# EAGLE design mainBoard (EAGLE 7.6.0)
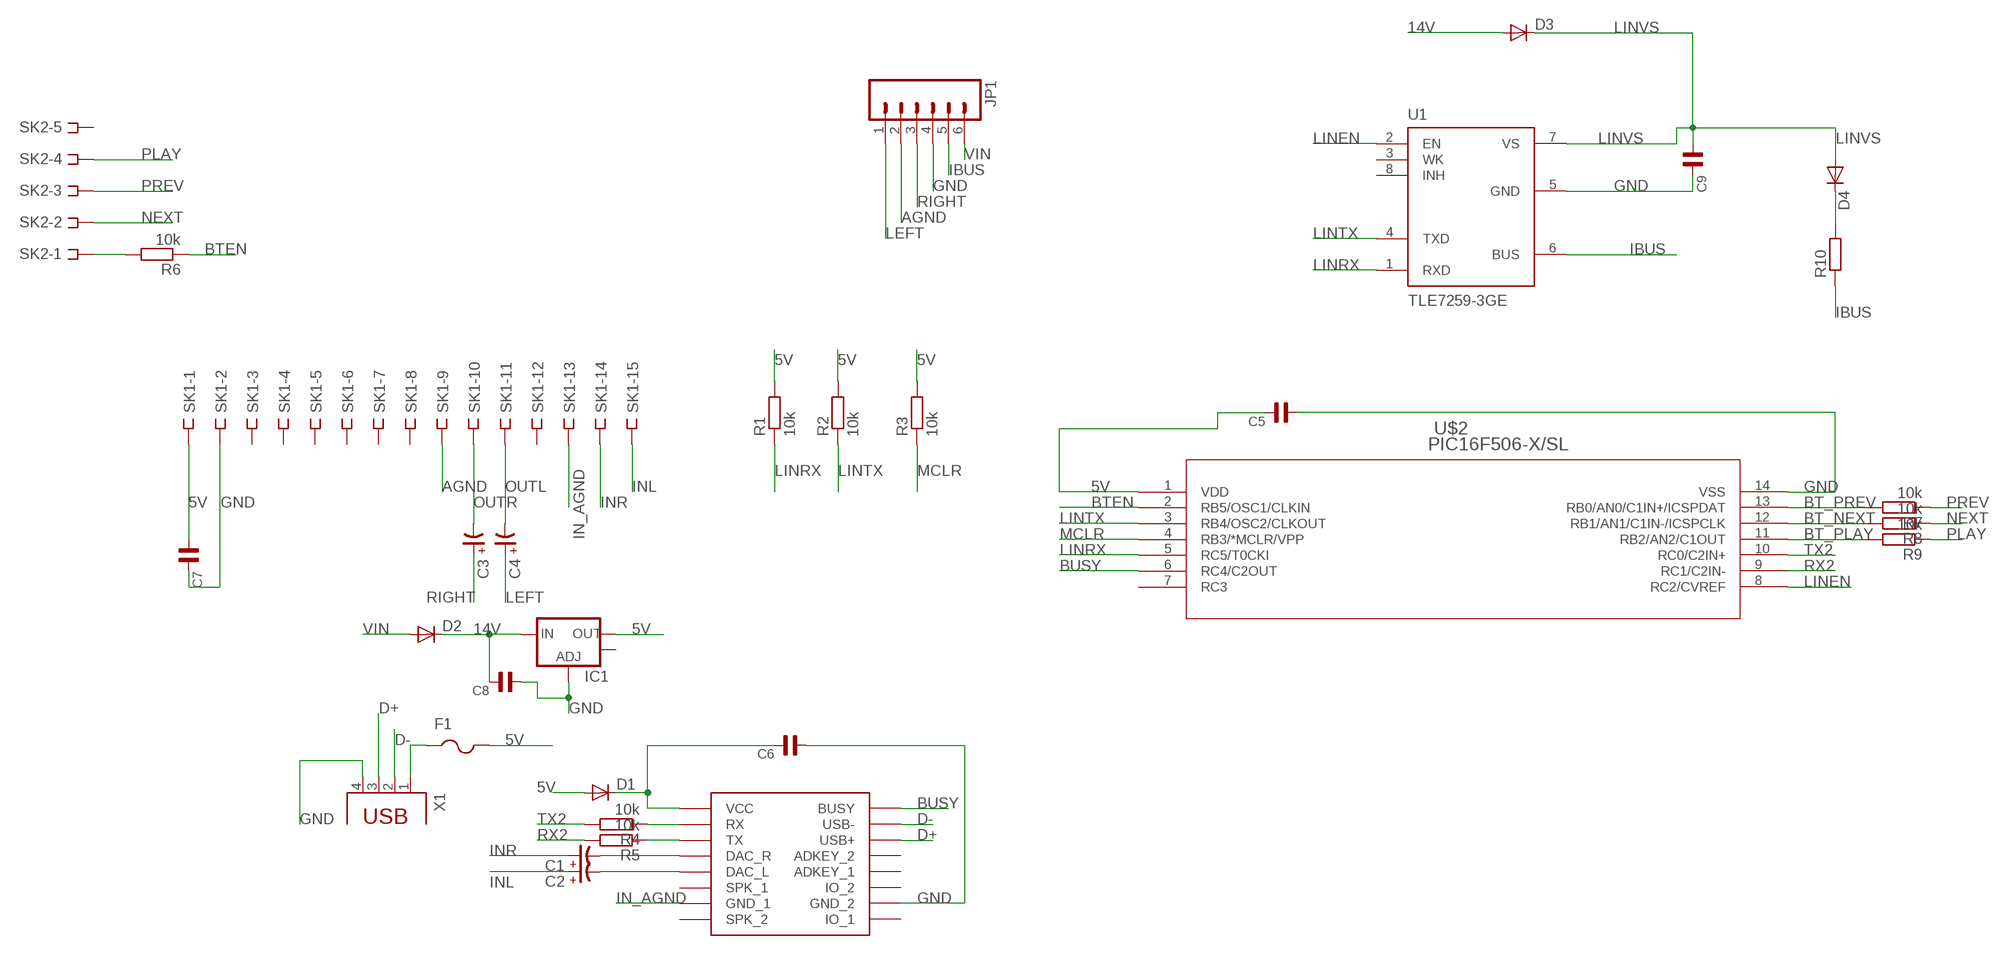
[diagram p0: schematic, sheet 1]

## Parts
C1  CP-3258-TE-B  [3528-TE-B]
C2  CP-3258-TE-B  [3528-TE-B]
C3  CP-3258-TE-B  [3528-TE-B]
C4  CP-3258-TE-B  [3528-TE-B]
C5  C0603  [0603]
C6  C0603  [0603]
C7  C0603  [0603]
C8  C1206  [1206]
C9  C0603  [0603]
D1  DIODESMA-ALT  [SMA-DIODE_ALT]
D2  DIODESMA-ALT  [SMA-DIODE_ALT]
D3  DIODE-SOD80C  [SOD80C]
D4  DIODE-SOD80C  [SOD80C]
F1  PTCFUSE-1812  [1812]
IC1  V_REG_LM1117SOT223  [SOT223]
JP1  M06LONGPADS  [1X06_LONGPADS]
R1  10k  R-EU_R0603  [R0603]
R2  10k  R-EU_R0603  [R0603]
R3  10k  R-EU_R0603  [R0603]
R4  10k  R-EU_R0603  [R0603]
R5  10k  R-EU_R0603  [R0603]
R6  10k  R-EU_R0603  [R0603]
R7  10k  R-EU_R0603  [R0603]
R8  10k  R-EU_R0603  [R0603]
R9  10k  R-EU_R0603  [R0603]
R10  R-EU_R0603  [R0603]
SK1  DF3-15S  [DF3S-15]
SK2  DF3-05S  [DF3S-05]
U1  TLE7259-3GE  [SOIC127P600X175-8N-3]
U$1  DFPLAYER  [DFPLAYER]
U$2  PIC16F506-X/SL  [SOIC14-N_MC]
X1  PN87520  [PN87520]

## Nets
5V: C5.2 C7.1 D1.A F1.2 IC1.2(OUT) R1.2 R2.2 R3.2 SK1.1 U$2.1(VDD)
14V: C8.2 D2.C D3.A IC1.3(IN)
AGND: JP1.2 SK1.9
BT_NEXT: R8.2 U$2.12(RB1/AN1/C1IN-/ICSPCLK)
BT_PLAY: R9.2 U$2.11(RB2/AN2/C1OUT)
BT_PREV: R7.2 U$2.13(RB0/AN0/C1IN+/ICSPDAT)
BTEN: R6.1 U$2.2(RB5/OSC1/CLKIN)
BUSY: U$1.BUSY U$2.6(RC4/C2OUT)
D+: U$1.USB+ X1.3
D-: U$1.USB- X1.2
GND: C5.1 C6.1 C7.2 C8.1 C9.2 IC1.1(ADJ) JP1.4 SK1.2 U1.5(GND) U$1.GND_2 U$2.14(VSS) X1.4
IBUS: JP1.5 R10.1 U1.6(BUS)
IN_AGND: SK1.13 U$1.GND_1
INL: C2.+ SK1.15
INR: C1.+ SK1.14
LEFT: C4.+ JP1.1
LINEN: U1.2(EN) U$2.8(RC2/CVREF)
LINRX: R1.1 U1.1(RXD) U$2.5(RC5/T0CKI)
LINTX: R2.1 U1.4(TXD) U$2.3(RB4/OSC2/CLKOUT)
LINVS: C9.1 D3.C D4.A U1.7(VS)
MCLR: R3.1 U$2.4(RB3/*MCLR/VPP)
N$1: C2.- U$1.DAC_L
N$2: C1.- U$1.DAC_R
N$3: C6.2 D1.C U$1.VCC
N$4: R4.1 U$1.RX
N$5: R5.1 U$1.TX
N$6: F1.1 X1.1
N$7: D4.C R10.2
N$8: R6.2 SK2.1
NEXT: R8.1 SK2.2
OUTL: C4.- SK1.11
OUTR: C3.- SK1.10
PLAY: R9.1 SK2.4
PREV: R7.1 SK2.3
RIGHT: C3.+ JP1.3
RX2: R5.2 U$2.9(RC1/C2IN-)
TX2: R4.2 U$2.10(RC0/C2IN+)
VIN: D2.A JP1.6
Unconnected: IC1.4(OUT) SK1.3 SK1.4 SK1.5 SK1.6 SK1.7 SK1.8 SK1.12 SK2.5 U1.3(WK) U1.8(INH) U$1.ADKEY1(ADKEY_1) U$1.ADKEY2(ADKEY_2) U$1.IO1(IO_1) U$1.IO2(IO_2) U$1.SPK1(SPK_1) U$1.SPK2(SPK_2) U$2.7(RC3)

## Library data of the parts
C1-C4 = cap-master:CP-: POLARIZED CAP
C5-C7 C9 = capsmd:C0603
C8 = capsmd:C1206
D1 D2 = SparkFun-DiscreteSemi:DIODE: Diode These are standard reverse protection diodes and small signal diodes. SMA package can handle up to about 1A. SOD-323 can handle about 200mA. What the SOD-323 package when ordering, there are some mfgs out there that are 5-pin packages.
D3 D4 = _mod_diode:DIODE-: DIODE
F1 = adafruit:PTCFUSE: PTC fuses, resettable thermistors
IC1 = SparkFun-PowerIC:V_REG_LM1117: Voltage Regulator LM1117 Standard adjustable voltage regulator but in SMD form. Spark Fun Electronics SKU : COM-00595
JP1 = SparkFun-Connectors:M06: Header 6 Standard 6-pin 0.1" header. Use with straight break away headers (SKU : PRT-00116), right angle break away headers (PRT-00553), swiss pins (PRT-00743), machine pins (PRT-00117), and female headers (PRT-00115). Molex polarized connector foot print use with SKU : PRT-08094 with associated crimp pins and housings. NOTES ON THE VARIANTS LOCK and LOCK_LONGPADS... This footprint was designed to help hold the alignment of a through-hole component (i.e. 6-pin header) while soldering it into place. You may notice that each hole has been shifted either up or down by 0.005 of an inch from it's more standard position (which is a perfectly straight line). This slight alteration caused the pins (the squares in the middle) to touch the edges of the holes. Because they are alternating, it causes a "brace" to hold the component in place. 0.005 has proven to be the perfect amount of "off-center" position when using our standard breakaway headers. Although looks a little odd when you look at the bare footprint, once you have a header in there, the alteration is very hard to notice. Also,if you push a header all the way into place, it is covered up entirely on the bottom side. This idea of altering the position of holes to aid alignment will be further integrated into the Sparkfun Library for other footprints. It can help hold any component with 3 or more connection pins.
R1-R10 = resistor:R-EU_: RESISTOR, European symbol
SK1 = con-hirose-df3:DF3-15S: Single row female connector 2mm 15 way
SK2 = con-hirose-df3:DF3-05S: Single row female connector 2mm 5 way
U1 = TLE7259-3GE:TLE7259-3GE: TLE7259-3GE Single Wire LIN Transceiver SOIC127P600X175-8N-3
U$1 = DFPlayer_v1:DFPLAYER
U$2 = PIC16F506_SOIC:PIC16F506-X/SL
X1 = con-berg:PN87520: BERG USB connector; OC_FARNELL: unknown; OC_NEWARK: unknown

## Board
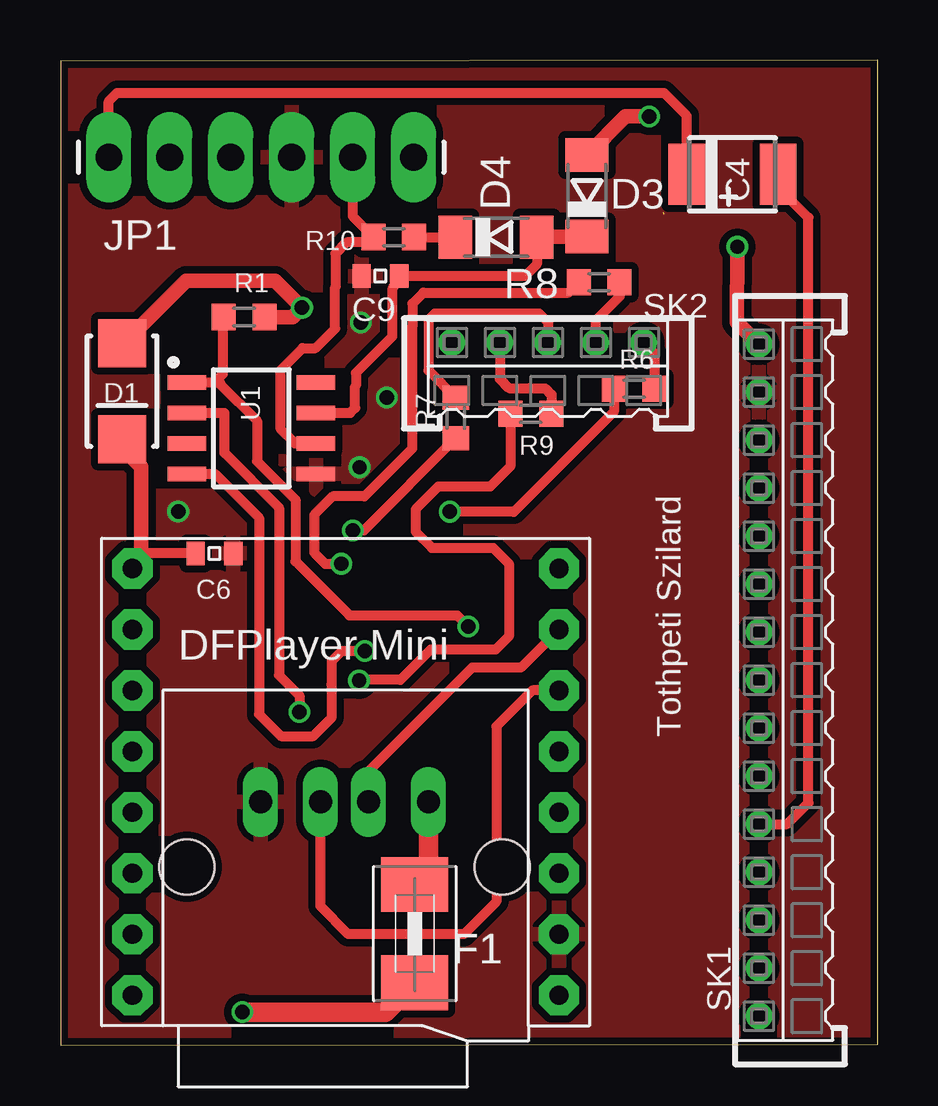
[diagram p1: board, top side]
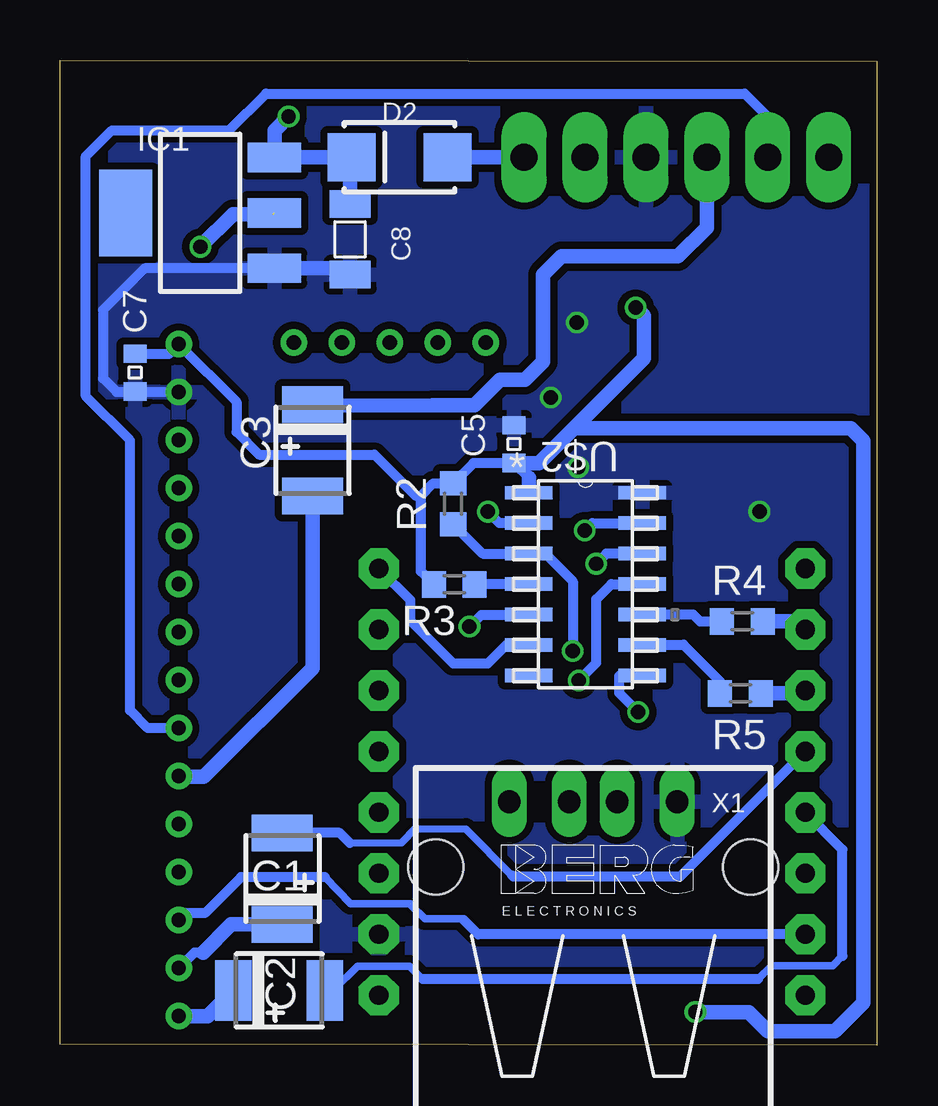
[diagram p2: board, bottom side, seen from below]

Size 34.05 x 41.05 mm. Coordinates in mm from the lower left corner, seen from the top.
Outline: 0,0 34.05,0.05 34.05,41.05 0,41 0,0
Copper layers (1*16): Top 0.035mm / dielectric 1.5mm / Bottom 0.035mm
Design rules "dirt_cheap_dirty_boards.v1.1": minimum track width 6mil, minimum drill 12mil, track to track 6mil, track to pad 6mil, pad to pad 6mil, via to via 6mil, smd to smd 0mil, copper to edge 10mil, drill to drill 10mil, minimum pad ring 10mil, minimum via ring 6mil, stop-mask expansion 2mil, vias tented up to drill 25mil, thermal gap 10mil

### Footprints (pad centres in the part's own frame; a part is rotated, then mirrored left to right if it is on the bottom)
3528-TE-B = smd 1.524 x 2.54: + 1.905,0; - -1.905,0
0603 = smd 0.762 x 0.965: 1 -0.787,0; 2 0.787,0
1206 = smd 1.143 x 1.702: 1 -1.473,0; 2 1.473,0
SMA-DIODE_ALT = smd 2 x 2: A -2,0; C 2,0
SOD80C = smd 1.4 x 1.8: A 1.7,0; C -1.7,0
1812 = smd 2.286 x 2.794: 1 -2.046,0; 2 2.046,0
SOT223 = smd 1.219 x 2.235: 1 -2.311,-3.099; 2 0,-3.099; 3 2.311,-3.099 | smd 3.6 x 2.2: 4 0,3.099
1X06_LONGPADS = drill 1.118 pad 1.88 long: 1 0,0; 2 2.54,0; 3 5.08,0; 4 7.62,0; 5 10.16,0; 6 12.7,0
R0603 = smd 1 x 1.1: 1 -0.85,0; 2 0.85,0
DF3S-15 = drill 0.6: 1 -14,-1; 2 -12,-1; 3 -10,-1; 4 -8,-1; 5 -6,-1; 6 -4,-1; 7 -2,-1; 8 0,-1; 9 2,-1; 10 4,-1; 11 6,-1; 12 8,-1; 13 10,-1; 14 12,-1; 15 14,-1
DF3S-05 = drill 0.6: 1 -4,-1; 2 -2,-1; 3 0,-1; 4 2,-1; 5 4,-1
SOIC127P600X175-8N-3 = smd 1.6 x 0.61: 1 -2.692,1.905; 2 -2.692,0.635; 3 -2.692,-0.635; 4 -2.692,-1.905; 5 2.692,-1.905; 6 2.692,-0.635; 7 2.692,0.635; 8 2.692,1.905
DFPLAYER = drill 0.8 pad 1.676 octagon: ADKEY1 8.89,-1.27; ADKEY2 8.89,1.27; BUSY 8.89,8.89; DAC_L -8.89,-1.27; DAC_R -8.89,1.27; GND_1 -8.89,-6.35; GND_2 8.89,-6.35; IO1 8.89,-8.89; IO2 8.89,-3.81; RX -8.89,6.35; SPK1 -8.89,-3.81; SPK2 -8.89,-8.89; TX -8.89,3.81; USB+ 8.89,3.81; USB- 8.89,6.35; VCC -8.89,8.89
SOIC14-N_MC = smd 1.981 x 0.559: 1 -2.362,3.81; 2 -2.362,2.54; 3 -2.362,1.27; 4 -2.362,0; 5 -2.362,-1.27; 6 -2.362,-2.54; 7 -2.362,-3.81; 8 2.362,-3.81; 9 2.362,-2.54; 10 2.362,-1.27; 11 2.362,0; 12 2.362,1.27; 13 2.362,2.54; 14 2.362,3.81
PN87520 = drill 0.95 long: 1 -3.5,2.71; 2 -1,2.71; 3 1,2.71; 4 3.5,2.71 | hole 2.3: -6.57,0; 6.57,0

### Placement (x,y rotation side)
C1  24.78,6.94 270 bottom
C2  24.91,2.28 180 bottom
C3  23.52,24.79 90 bottom
C4  28,36.28 180 top
C5  15.12,25.04 270 bottom
C6  6.4,20.49 180 top
C7  30.92,28.02 270 bottom
C8  21.95,33.58 90 bottom
C9  13.32,32.05 180 top
D1  2.55,27.25 270 top
D2  19.9,37 180 bottom
D3  21.93,35.39 90 top
D4  18.14,33.67 0 top
F1  14.75,4.65 270 top
IC1  28.21,34.68 90 bottom
JP1  2,37 0 top
R1  7.64,30.34 0 top
R2  17.66,22.56 90 bottom
R3  17.61,19.2 180 bottom
R4  5.6,17.66 180 bottom
R5  5.68,14.66 180 bottom
R6  23.9,27.35 0 top
R7  16.46,26.13 270 top
R8  22.44,31.79 180 top
R9  19.59,26.31 180 top
R10  13.88,33.67 0 top
SK1  30.1,15.21 270 top
SK2  20.3,28.28 180 top
U1  7.94,25.71 0 top
U$1  11.87,10.97 0 top
U$2  12.14,19.21 0 bottom
X1  11.82,7.43 0 bottom

### Tracks (layer width: path | path; a pad name or v marks a point on that pad's centre or on a via)
5V  (via drill 0.6)  (1 unrouted)
  Top 0.61: SK1.1 28.18,30.13 v28.2,33.27 | 8.96,30.34 R1.2 9.66,30.34 v10.05,30.73 8.92,31.86 5.22,31.86 2.61,29.25 D1.A
  Top 0.813: F1.2 13.53,1.38 v7.56,1.38
  Bottom 0.406: 14.5,23.64 C5.2 16.82,24.25 R2.2 18.49,23.41 19,22.9 | R3.2 19,19.74 19,22.9 | C7.1 29.5,28.81 SK1.1 26.69,26.8 26.69,25.55 25.75,24.61 20.94,24.61 19.23,22.9 19,22.9
  Bottom 0.61: v7.56,1.38 5.33,1.38 4.54,0.59 1.74,0.59 0.57,1.76 0.57,25.19 1.08,25.7 12.63,25.7 | U$2.1 14.5,23.64 | C5.2 14.08,24.25 12.63,25.7 | 12.63,25.7 9.71,28.62 9.71,30.39 v10.05,30.73 | 25.16,34.63 26.84,34.63 v28.2,33.27
14V  (via drill 0.6)
  Top 0.61: D3.A 23.54,38.7 v24.52,38.7
  Bottom 0.61: C8.2 21.95,36.95 D2.C IC1.3 25.11,38.11 v24.52,38.7
AGND
  Bottom 0.406: SK1.9 30.39,13.21 31.13,13.95 31.13,25.2 32.97,27.04 32.97,37.04 31.89,38.12 26.99,38.12 25.46,39.65 5.5,39.65 4.48,38.63 4.48,37.06 JP1.2
BT_NEXT  (via drill 0.6)
  Top 0.406: v11.69,20.06 11.02,20.06 10.56,20.52 10.56,22.1 11.33,22.87 12.65,22.87 14.64,24.86 14.64,29.93 14.65,29.94 14.65,30.9 15.11,31.36 21.16,31.36 R8.2
  Bottom 0.406: U$2.12 11.27,20.48 v11.69,20.06
BT_PLAY  (via drill 0.6)
  Top 0.406: R9.2 18.74,24.12 17.89,23.27 15.73,23.27 14.79,22.33 14.79,21.4 15.47,20.72 18.02,20.72 18.67,20.07 18.67,17.03 18.12,16.48 15.41,16.48 14.15,15.22 12.46,15.22 v12.43,15.19
  Bottom 0.406: v12.43,15.19 11.69,15.93 11.69,18.59 11.07,19.21 U$2.11
BT_PREV  (via drill 0.6)
  Top 0.406: R7.2 12.62,21.44 v12.17,21.44
  Bottom 0.406: v12.17,21.44 11.86,21.75 U$2.13
BTEN  (via drill 0.6)
  Top 0.406: v16.21,22.23 v16.22,22.22 18.88,22.22 23.05,26.39 R6.1
  Bottom 0.406: U$2.2 15.73,21.75 v16.21,22.23
BUSY
  Bottom 0.406: U$1.BUSY 19.45,18.55 19.45,17.7 17.66,15.91 16.21,15.91 15.44,16.68 14.51,16.68 U$2.6
D+
  Top 0.406: U$1.USB+ 19.65,14.78 18.15,13.28 18.15,5.98 16.8,4.63 11.98,4.63 10.82,5.79 X1.3
D-
  Top 0.406: U$1.USB- 19.17,15.73 17.14,15.73 12.82,11.41 X1.2
GND  (via drill 0.6)
  Bottom 0.406: SK1.2 29.12,27.23 C7.2 30.93,27.22 31.69,27.22 32.25,27.78 32.25,30.64 30.52,32.37 IC1.1
  Bottom 0.61: IC1.1 22.21,32.37 C8.1
  other vias: 12.45,24.08 4.89,22.24 13.59,26.99 12.5,30.11
  pour Bottom (isolate 0.305): 0,0 34.05,0 34.05,41.05 0,41.05
  pour Top (isolate 0.305): 0,0 34.05,0 34.05,41.05 0,41.05
IBUS
  Top 0.406: JP1.5 12.16,34.54 R10.1 12.81,33.45 11.91,33.45 11.44,32.98 11.44,31.59 11.43,31.58 11.43,29.86 10.61,29.04 10.07,29.04 9.16,28.13 9.16,25.67 9.76,25.07 U1.6
IN_AGND  (1 unrouted)
  Bottom 0.305: 19.44,5.9 21.94,5.9 23,7 | 19.43,5.89 19.43,5.85 18.84,5.26 17.2,5.26 17.2,5.2
  Bottom 0.406: U$1.GND_1 16.62,4.62 17.2,5.2 | 23,7 26.5,7 28,5.5 28.81,5.5 SK1.13
INL
  Bottom 0.61: SK1.15 27.89,1.21 C2.+
INR
  Bottom 0.406: C1.+ 25.75,5.04 | 28.09,3.86 28.45,3.86 SK1.14
  Bottom 0.61: 25.75,5.04 26.91,5.04 28.09,3.86
LEFT
  Top 0.406: JP1.1 2,39.34 2.34,39.68 25.14,39.68 26.09,38.73 C4.+
LINEN  (via drill 0.6)
  Top 0.406: U1.2 6.82,26.34 6.82,24.68 9.09,22.4 9.09,15.42 9.94,14.57 v9.94,13.88
  Bottom 0.406: v9.94,13.88 10.73,14.67 10.73,15.38 10.71,15.4 U$2.8
LINRX  (via drill 0.6)
  Top 0.406: U1.1 6.41,27.61 | 6.41,27.61 6.76,27.97 6.76,30.31 R1.1 | 6.41,27.61 6.63,27.61 6.63,27.55 8.17,26.01 8.17,24.34 9.78,22.73 9.78,20.16 12.03,17.91 16.52,17.91 v16.98,17.45
  Bottom 0.406: v16.98,17.45 16.96,17.45 16.48,17.93 14.51,17.93 U$2.5
LINTX  (via drill 0.6)
  Top 0.406: U1.4 6.42,23.8 8.26,21.97 8.26,13.79 9.17,12.88 10.52,12.88 11.28,13.64 11.28,15.03 11.29,15.04 11.29,16 11.71,16.42 v12.67,16.42
  Bottom 0.406: R2.1 16.43,20.48 U$2.3 13.82,20.48 12.67,19.33 v12.67,16.42
LINVS
  Top 0.406: D4.A 19.84,32.54 19.34,32.04 C9.1 13.81,31.49 13.81,29.52 12.3,28.01 12.3,27.48 12.27,27.45 12.27,26.56 12.05,26.34 U1.7
  Top 0.61: D4.A 19.86,33.69 D3.C
MCLR
  Bottom 0.406: U$2.4 14.51,19.2 R3.1
N$1
  Bottom 0.305: C2.- 22.66,2.28 21.64,3.3 19.48,3.3 18.93,2.75 | 4.95,2.75 4.38,3.32 1.83,3.32 1.43,3.72
  Bottom 0.406: 1.43,3.72 1.43,8.15 U$1.DAC_L | 4.95,2.75 18.93,2.75
N$2
  Bottom 0.305: 21.96,8.42 19.82,8.43 19.24,9.01 17.13,9 15.2,7.07 15.19,7.07
  Bottom 0.406: U$1.DAC_R 8.19,7.03 15.15,7.03 15.19,7.07 | 21.96,8.42 22.39,8.85 C1.-
N$3
  Top 0.406: C6.2 3.39,20.49 3.34,20.44
  Top 0.61: D1.C 2.55,24.89 3.34,24.1 3.34,20.44 3.34,20.22 U$1.VCC
N$4
  Bottom 0.61: U$1.RX 3.32,17.66 R4.1
N$5
  Bottom 0.61: U$1.TX 3.1,14.66 R5.1
N$6
  Top 0.406: F1.1 15.32,7.27
  Top 0.813: 15.32,7.27 X1.1
N$7
  Top 0.406: R10.2 D4.C
N$8
  Top 0.406: 25.04,27.64 R6.2 24.75,28.83 SK2.1
NEXT
  Top 0.406: SK2.2 22.3,30.2 23.29,31.19 R8.1
OUTL
  Top 0.406: SK1.11 30.27,9.21 31.16,10.1 31.16,34.48 29.91,35.73 C4.-
OUTR
  Bottom 0.61: SK1.10 29.07,11.18 28.05,11.18 23.52,15.71 C3.-
PLAY
  Top 0.406: R9.1 20.45,27.11 20.19,27.37 19.55,27.37 19.54,27.38 18.68,27.38 18.3,27.76 SK2.4
PREV
  Top 0.406: R7.1 15.32,28.12 15.32,30.22 15.59,30.49 19.93,30.49 20.3,30.12 SK2.3
RIGHT
  Bottom 0.61: JP1.3 7.09,34.07 8.28,32.88 13.14,32.88 13.92,32.1 13.92,28.48 14.67,27.73 15.7,27.73 16.77,26.66 18.52,26.66 23.46,26.64 C3.+
RX2
  Bottom 0.406: U$2.9 9.76,16.69 8.06,16.69 6.53,15.16 R5.2
TX2
  Bottom 0.406: U$2.10 9.77,17.95 7.66,17.95 7.37,17.66 R4.2
VIN
  Bottom 0.61: JP1.6 D2.A

### Text on the board
tNames: Tothpeti Szilard